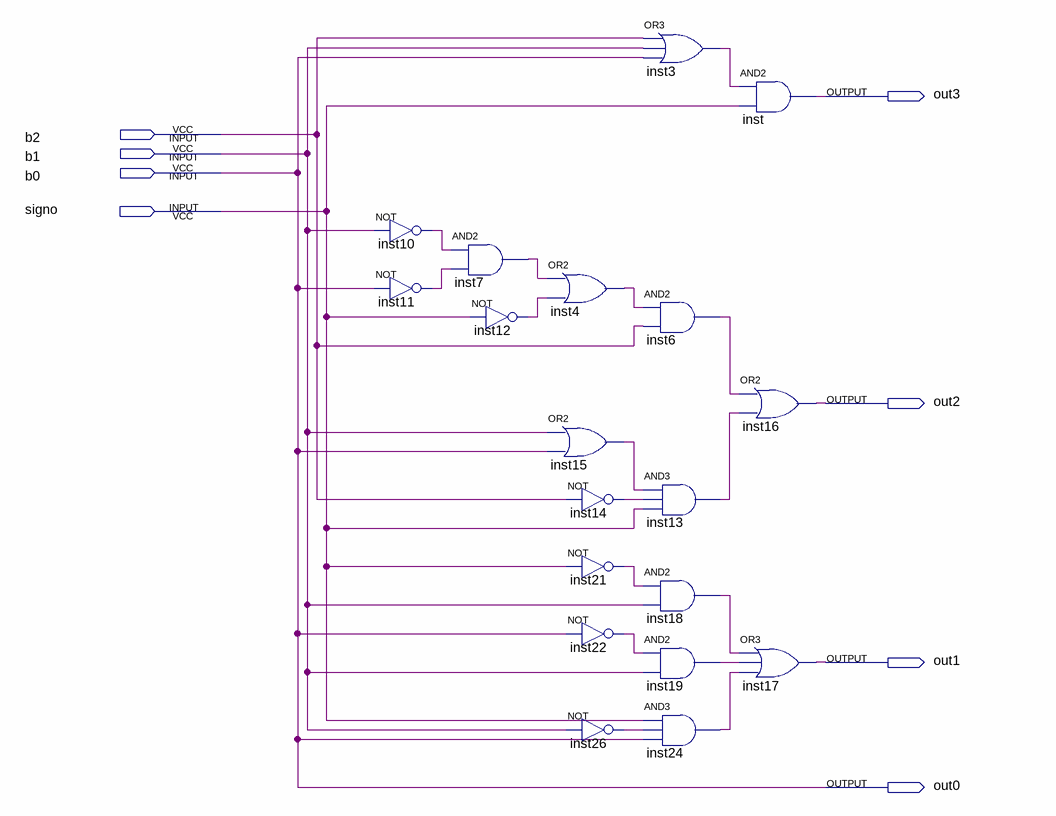
[diagram p0: schematic sheet]
// Quartus schematic ConvertirBCSaCa2.bdf as structural Verilog: 19 symbols, 8 pins
module ConvertirBCSaCa2 (
  input  b2,
  input  b1,
  input  b0,
  input  signo,
  output out3,
  output out2,
  output out1,
  output out0
);

  wire inst3_out, inst4_out, inst6_out, inst7_out, inst10_out, inst11_out, inst12_out, inst13_out,
       inst14_out, inst15_out, inst18_out, inst19_out, inst21_out, inst22_out, inst24_out, inst26_out;

  not inst10 (inst10_out, b1);
  not inst11 (inst11_out, b0);
  and inst7 (inst7_out, inst10_out, inst11_out);
  not inst12 (inst12_out, signo);
  or inst4 (inst4_out, inst7_out, inst12_out);
  or inst15 (inst15_out, b1, b0);
  not inst14 (inst14_out, b2);
  not inst21 (inst21_out, signo);
  not inst22 (inst22_out, b0);
  not inst26 (inst26_out, b1);
  or inst3 (inst3_out, b2, b1, b0);
  and inst6 (inst6_out, inst4_out, b2);
  and inst13 (inst13_out, inst15_out, inst14_out, signo);
  and inst18 (inst18_out, inst21_out, b1);
  and inst19 (inst19_out, inst22_out, b1);
  and inst24 (inst24_out, signo, inst26_out, b0);
  and inst (out3, inst3_out, signo);
  or inst16 (out2, inst6_out, inst13_out);
  or inst17 (out1, inst18_out, inst19_out, inst24_out);

  assign out0 = b0;
endmodule
